# EAGLE design lem_current_sensor (EAGLE 7.4.0)
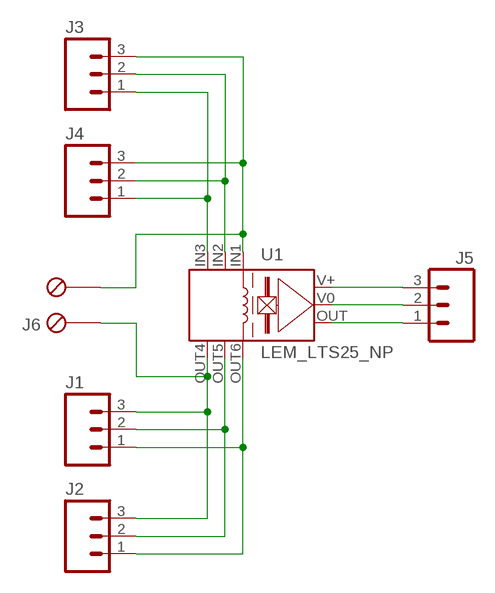
[diagram p0: schematic, sheet 1]

## Parts
J1  M03LONGPADS  [1X03_LONGPADS]
J2  M03LONGPADS  [1X03_LONGPADS]
J3  M03LONGPADS  [1X03_LONGPADS]
J4  M03LONGPADS  [1X03_LONGPADS]
J5  M03LONGPADS  [1X03_LONGPADS]
J6  METALTEX-2  [METALTEX-2]
U1  LEM_LTS25_NP  [LTS25_NP]

## Nets
GND: J5.2 U1.V0(0V)
IP+: J3.3 J4.3 J6.P2 U1.IN1
IP-: J1.3 J2.3 J6.P1 U1.OUT4
N$2: J1.2 J2.2 U1.OUT5
N$3: J1.1 J2.1 U1.OUT6
N$4: J3.1 J4.1 U1.IN3
N$5: J3.2 J4.2 U1.IN2
N$7: J5.1 U1.OUT(VOUT)
N$9: J5.3 U1.V+

## Library data of the parts
J1-J5 = uchile_robotics_eagle_lib:M03: Header 3 Standard 3-pin 0.1" header. Use with straight break away headers (SKU : PRT-00116), right angle break away headers (PRT-00553), swiss pins (PRT-00743), machine pins (PRT-00117), and female headers (PRT-00115). Molex polarized connector foot print use with SKU : PRT-08232 with associated crimp pins and housings.
J6 = uchile_robotics_eagle_lib:METALTEX-2
U1 = uchile_robotics_eagle_lib:LEM_LTS25_NP: LEM LTS 25-NP Digikey: 398-1002-ND Datasheet: http://www.lem.com/docs/products/lts%2025-np.pdf

## Board
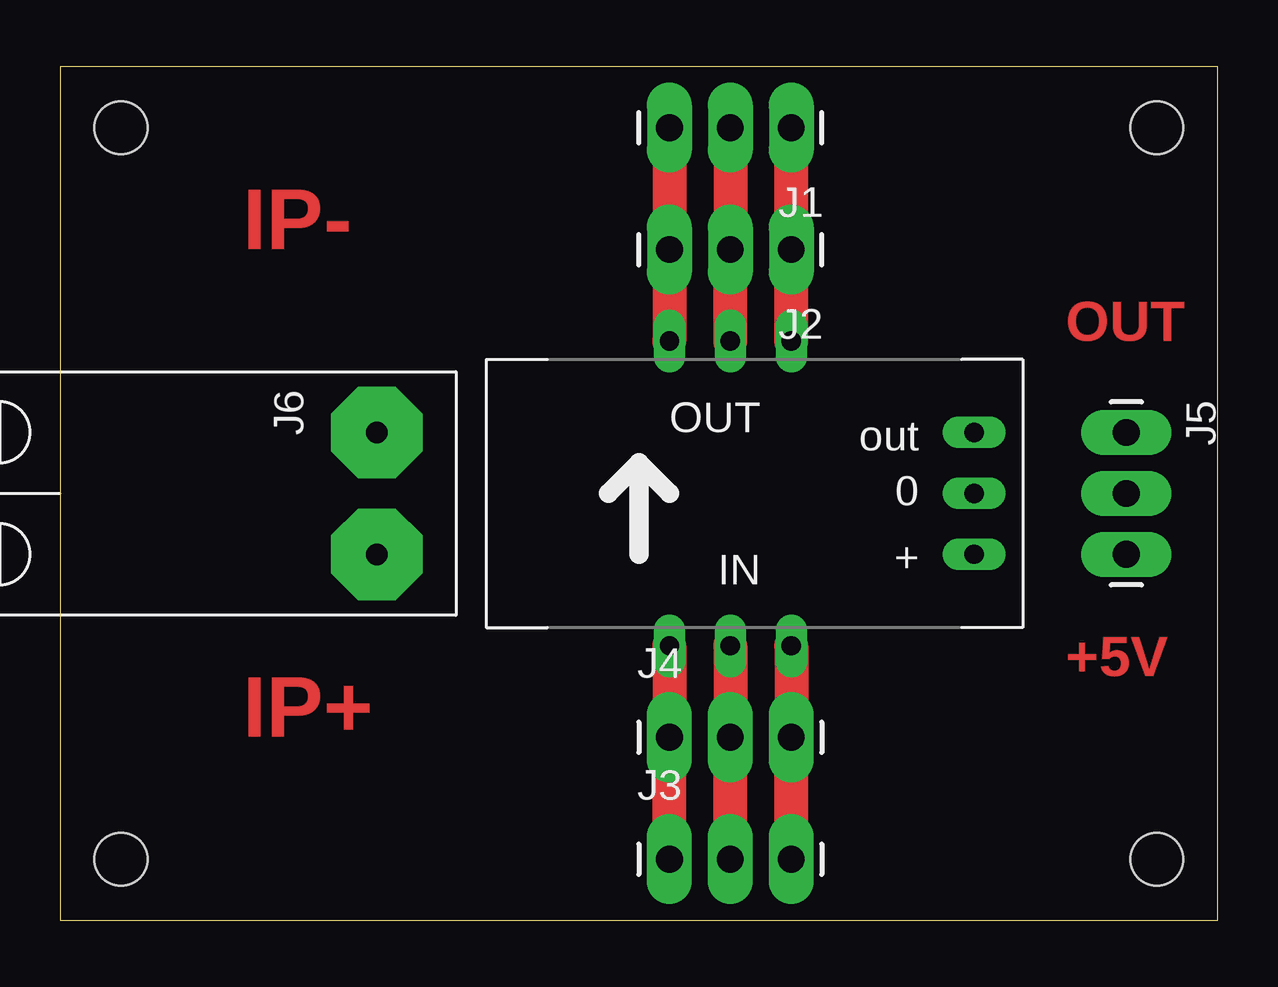
[diagram p1: board, top side]
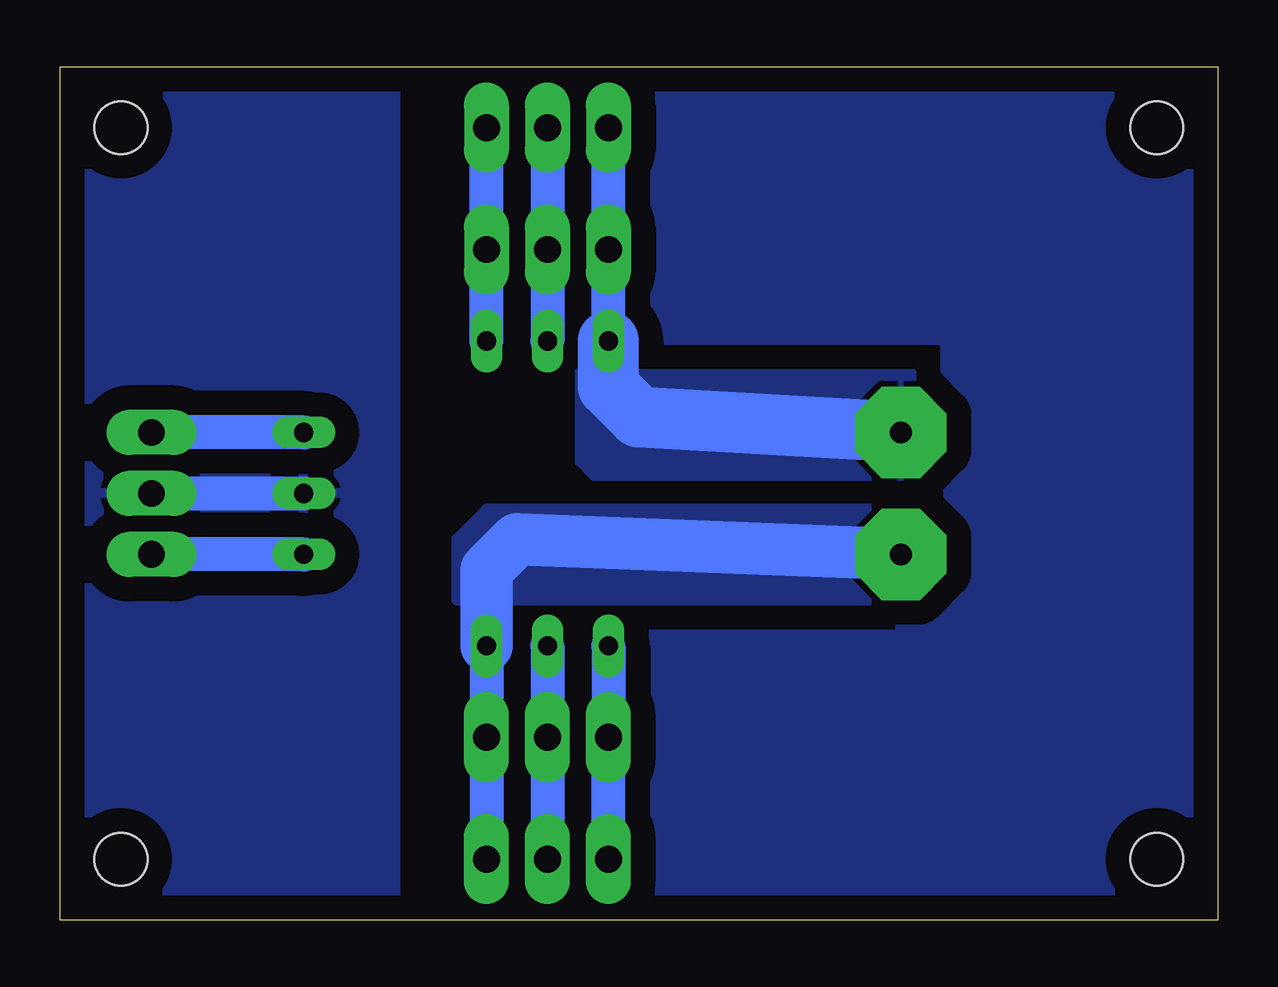
[diagram p2: board, bottom side, seen from below]

Size 48.26 x 35.56 mm. Coordinates in mm from the lower left corner, seen from the top.
Outline: 0,0 48.26,0 48.26,35.56 0,35.56 0,0
Copper layers (1*16): Top 0.035mm / dielectric 1.5mm / Bottom 0.035mm
Design rules "default": minimum track width 10mil, minimum drill 24mil, track to track 8mil, track to pad 8mil, pad to pad 8mil, via to via 8mil, smd to smd 8mil, copper to edge 40mil, drill to drill 8mil, minimum pad ring 10mil, minimum via ring 8mil, stop-mask expansion 4mil, vias tented up to drill 0mil, thermal gap 10mil
Holes 2.2 mm at 2.54,33.02 2.54,2.54 45.72,33.02 45.72,2.54

### Footprints (pad centres in the part's own frame; a part is rotated, then mirrored left to right if it is on the bottom)
1X03_LONGPADS = drill 1.118 pad 1.88 long: 1 0,0; 2 2.54,0; 3 5.08,0
METALTEX-2 = drill 0.9 pad 3.81 octagon: P1 -2.54,1.778; P2 2.54,1.778
LTS25_NP = drill 0.8 long: IN1 7.62,6.35; IN2 10.16,6.35; IN3 12.7,6.35; OUT 0,-2.54; OUT4 12.7,-6.35; OUT5 10.16,-6.35; OUT6 7.62,-6.35; V0 0,0; V+ 0,2.54

### Placement (x,y rotation side)
J1  30.48,33.02 180 top
J2  30.48,27.94 180 top
J3  25.4,2.54 0 top
J4  25.4,7.62 0 top
J5  44.45,20.32 270 top
J6  11.43,17.78 270 top
U1  38.1,17.78 180 top

### Tracks (layer width: path | path; a pad name or v marks a point on that pad's centre or on a via)
GND
  Bottom 1.422: J5.2 U1.V0
  pour Bottom (isolate 1.016): 34.29,36.2 34.29,0.64 48.26,0.64 48.26,36.2
IP+
  Top 1.422: U1.IN1 J4.3 J3.3
  Bottom 1.422: U1.IN1 J4.3 J3.3
  Bottom 2.184: J6.P2 29.21,15.88 30.48,14.61 U1.IN1
  pour Bottom: 13.97,17.14 30.48,17.14 31.75,15.88 31.75,13.34 13.97,13.34
IP-
  Top 1.422: J1.3 J2.3 U1.OUT4
  Bottom 1.422: U1.OUT4 J1.3
  Bottom 2.54: J6.P1 24.13,20.95 25.4,22.23 U1.OUT4
  pour Bottom: 12.7,22.86 12.7,18.41 26.04,18.41 26.67,19.05 26.67,22.86
N$2
  Top 1.422: U1.OUT5 J2.2 J1.2
  Bottom 1.422: J1.2 J2.2 U1.OUT5
N$3
  Top 1.422: U1.OUT6 J2.1 J1.1
  Bottom 1.422: U1.OUT6 J2.1 J1.1
N$4
  Top 1.422: U1.IN3 J4.1 J3.1
  Bottom 1.422: U1.IN3 J4.1 J3.1
N$5
  Top 1.422: J3.2 J4.2 U1.IN2
  Bottom 1.422: J3.2 J4.2 U1.IN2
N$7
  Bottom 1.422: U1.OUT J5.1
N$9
  Bottom 1.422: U1.V+ J5.3
N$10
  pour Bottom (isolate 1.016, rank 2, no thermals): 0,36.2 24.13,36.2 24.13,0.64 0,0.64

### Text on the board
Top: IP- | OUT | +5V | IP+